# EAGLE design Port-Exp (EAGLE 7.6.0)
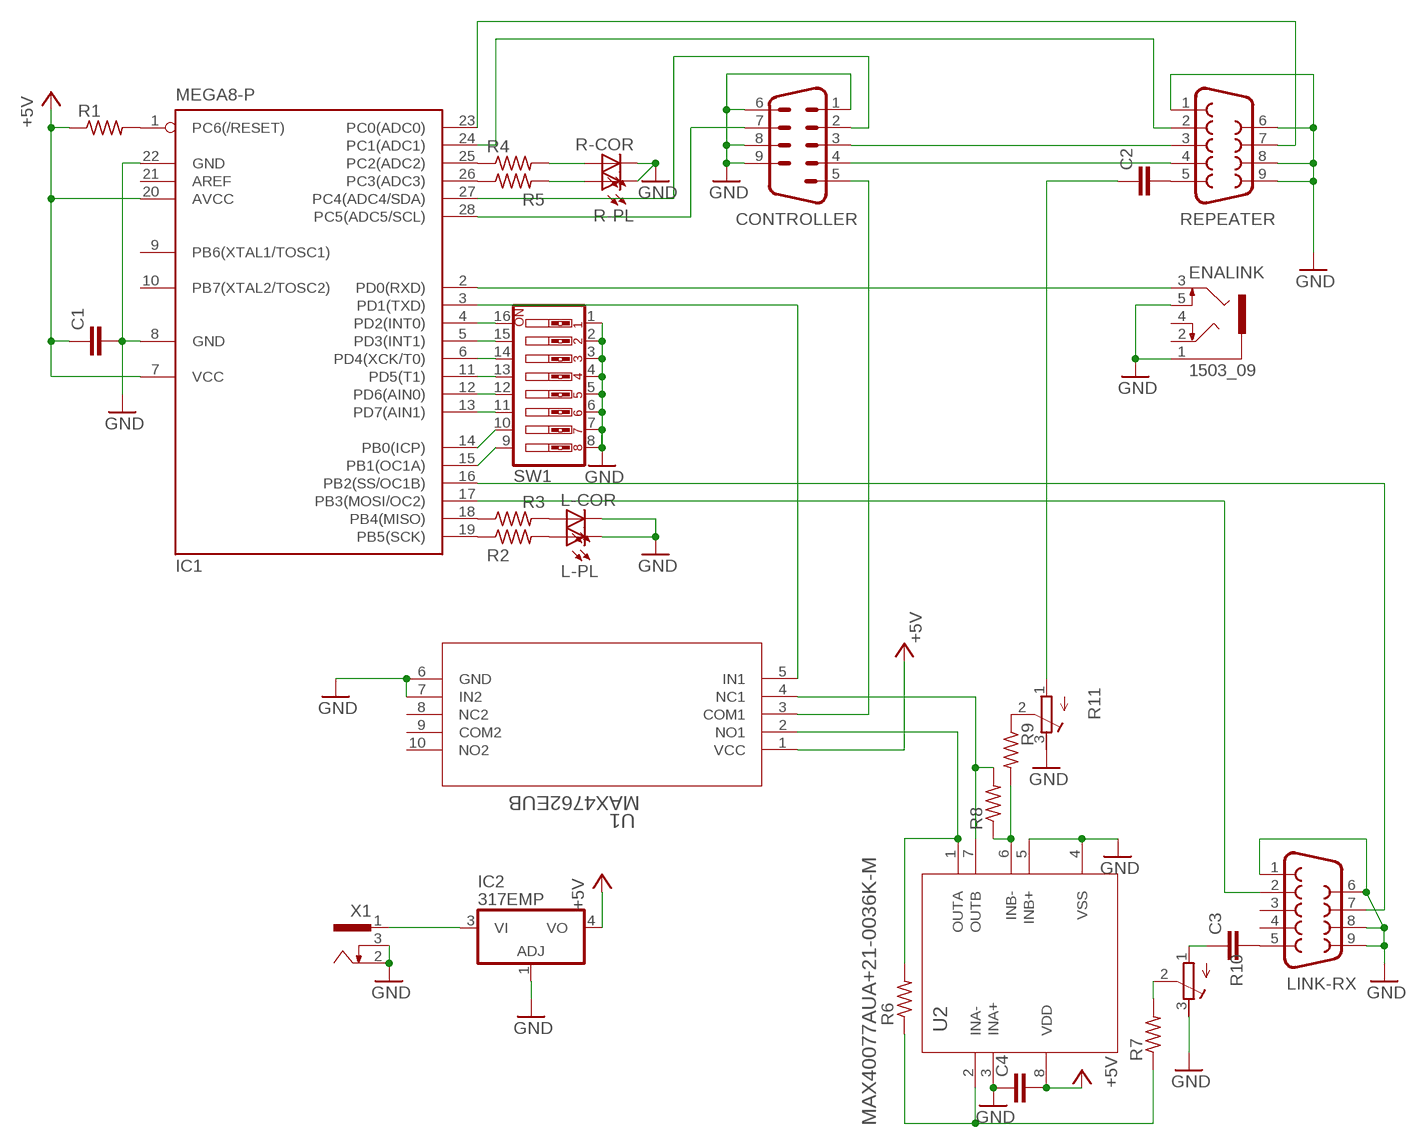
[diagram p0: schematic, sheet 1]

## Parts
C1  C-EUC0402K  [C0402K]
C2  C-EUC0402K  [C0402K]
C3  C-EUC0402K  [C0402K]
C4  C-EUC0402K  [C0402K]
CONTROLLER  M09D  [M09D]
ENALINK  1503_09  [1503_09]
IC1  MEGA8-P  [DIL28-3]
IC2  317EMP  [SOT223]
L-COR  LEDCHIPLED_0805  [CHIPLED_0805]
L-PL  LEDCHIPLED_0805  [CHIPLED_0805]
LINK-RX  F09D  [F09D]
R1  R-US_M0805  [M0805]
R2  R-US_M0805  [M0805]
R3  R-US_M0805  [M0805]
R4  R-US_M0805  [M0805]
R5  R-US_M0805  [M0805]
R6  R-US_M0805  [M0805]
R7  R-US_M0805  [M0805]
R8  R-US_M0805  [M0805]
R9  R-US_M0805  [M0805]
R10  R-TRIMM3339P  [RTRIM3339P]
R11  R-TRIMM3339P  [RTRIM3339P]
R-COR  LEDCHIPLED_0805  [CHIPLED_0805]
R-PL  LEDCHIPLED_0805  [CHIPLED_0805]
REPEATER  F09D  [F09D]
SW1  SW_DIP-8  [EDG-08]
U1  MAX4762EUB  [21-0061L]
U2  MAX40077AUA+21-0036K-M  [21-0036K-M]
X1  SCD-014A  [SCD-014-A]

## Nets
+5V: C1.1 C4.2 IC1.7(VCC) IC1.20(AVCC) IC2.4(VO) R1.1 U1.1(VCC) U2.8(VDD)
GND: C1.2 C4.1 CONTROLLER.1 CONTROLLER.6 CONTROLLER.8 CONTROLLER.9 ENALINK.1 ENALINK.5 IC1.8(GND) IC1.22(GND) IC2.1(ADJ) L-COR.C L-PL.C LINK-RX.1 LINK-RX.6 LINK-RX.8 LINK-RX.9 R10.3(E) R11.3(E) R-COR.C R-PL.C REPEATER.1 REPEATER.6 REPEATER.8 REPEATER.9 SW1.1 SW1.2 SW1.3 SW1.4 SW1.5 SW1.6 SW1.7 SW1.8 U1.6(GND) U1.7(IN2) U2.3(INA+) U2.4(VSS) U2.5(INB+) X1.2 X1.3
N$1: CONTROLLER.2 IC1.27(PC4(ADC4/SDA))
N$2: CONTROLLER.7 IC1.28(PC5(ADC5/SCL))
N$3: IC1.17(PB3(MOSI/OC2)) LINK-RX.2
N$4: CONTROLLER.3 REPEATER.3
N$5: CONTROLLER.4 REPEATER.4
N$6: IC1.24(PC1(ADC1)) REPEATER.2
N$7: IC1.4(PD2(INT0)) SW1.16
N$8: IC1.3(PD1(TXD)) U1.5(IN1)
N$9: IC1.16(PB2(SS/OC1B)) LINK-RX.7
N$10: CONTROLLER.5 U1.3(COM1)
N$11: IC1.23(PC0(ADC0)) REPEATER.7
N$12: IC1.5(PD3(INT1)) SW1.15
N$13: IC1.6(PD4(XCK/T0)) SW1.14
N$14: IC1.11(PD5(T1)) SW1.13
N$15: IC1.12(PD6(AIN0)) SW1.12
N$16: IC1.13(PD7(AIN1)) SW1.11
N$17: IC1.14(PB0(ICP)) SW1.10
N$18: IC1.15(PB1(OC1A)) SW1.9
N$19: IC1.1(PC6(/RESET)) R1.2
N$20: IC1.19(PB5(SCK)) R2.1
N$21: IC1.18(PB4(MISO)) R3.1
N$22: IC1.25(PC2(ADC2)) R4.1
N$23: IC1.26(PC3(ADC3)) R5.1
N$24: R4.2 R-COR.A
N$25: R5.2 R-PL.A
N$26: L-COR.A R3.2
N$27: L-PL.A R2.2
N$28: R6.2 U1.2(NO1) U2.1(OUTA)
N$29: R8.2 U1.4(NC1) U2.7(OUTB)
N$30: C2.2 REPEATER.5
N$31: C3.2 LINK-RX.5
N$32: R8.1 R9.2 U2.6(INB-)
N$33: R6.1 R7.1 U2.2(INA-)
N$34: R9.1 R11.2(S)
N$35: C3.1 R10.1(A)
N$36: R7.2 R10.2(S)
N$37: C2.1 R11.1(A)
N$38: ENALINK.3 IC1.2(PD0(RXD))
N$39: IC2.3(VI) X1.1
Unconnected: ENALINK.2 ENALINK.4 IC1.9(PB6(XTAL1/TOSC1)) IC1.10(PB7(XTAL2/TOSC2)) IC1.21(AREF) LINK-RX.3 LINK-RX.4 U1.8(NC2) U1.9(COM2) U1.10(NO2)

## Library data of the parts
C1-C4 = rcl:C-EU: CAPACITOR, European symbol
CONTROLLER = con-subd:M09: SUB-D; OC_FARNELL: unknown; OC_NEWARK: unknown
ENALINK = con-lumberg:1503_09: Jack connectors according to JISC 6560, 3.5 mm Klinkeneinbaukupplung nach JISC 6560, 3,5 mm, 3-polig/ stereo, abgewinkelte Ausführung, mit 2 Öffnern und Lötaugen, für Leiterplatten Rückseitenmontage Source: http://www.lumberg.com/Produkte/PDFs/1503_09.pdf; OC_FARNELL: 1243244; OC_NEWARK: unknown
IC1 = atmel:MEGA8-P: MICROCONTROLLER 8 Kbytes FLASH, 1 kbytes SRAM, 512 bytes EEPROM, USART, 4-channel 10 bit ADC, 2-channel 8 bit ADC Pin compatible with Atmega48, ATMega88, ATMega168 Source: avr.lbr; OC_FARNELL: unknown; OC_NEWARK: unknown
IC2 = linear:*317: Positive VOLTAGE REGULATOR
L-COR L-PL R-COR R-PL = led:LED: LED OSRAM: - CHIPLED LG R971, LG N971, LY N971, LG Q971, LY Q971, LO R971, LY R971 LH N974, LH R974 LS Q976, LO Q976, LY Q976 LO Q996 - Hyper CHIPLED LW Q18S LB Q993, LB Q99A, LB R99A - SideLED LS A670, LO A670, LY A670, LG A670, LP A670 LB A673, LV A673, LT A673, LW A673 LH A674 LY A675 LS A676, LA A676, LO A676, LY A676, LW A676 LS A679, LY A679, LG A679 - Hyper Micro SIDELED® LS Y876, LA Y876, LO Y876, LY Y876 LT Y87S - SmartLED LW L88C, LW L88S LB L89C, LB L89S, LG L890 LS L89K, LO L89K, LY L89K LS L896, LA L896, LO L896, LY L896 - TOPLED LS T670, LO T670, LY T670, LG T670, LP T670 LSG T670, LSP T670, LSY T670, LOP T670, LYG T670 LG T671, LOG T671, LSG T671 LB T673, LV T673, LT T673, LW T673 LH T674 LS T676, LA T676, LO T676, LY T676, LB T676, LH T676, LSB T676, LW T676 LB T67C, LV T67C, LT T67C, LS T67K, LO T67K, LY T67K, LW E67C LS E67B, LA E67B, LO E67B, LY E67B, LB E67C, LV E67C, LT E67C LW T67C LS T679, LY T679, LG T679 LS T770, LO T770, LY T770, LG T770, LP T770 LB T773, LV T773, LT T773, LW T773 LH T774 LS E675, LA E675, LY E675, LS T675 LS T776, LA T776, LO T776, LY T776, LB T776 LHGB T686 LT T68C, LB T68C - Hyper Mini TOPLED® LB M676 - Mini TOPLED Santana® LG M470 LS M47K, LO M47K, LY M47K Source: http://www.osram.convergy.de LUXEON: - LUMILED® LXK2-PW12-R00, LXK2-PW12-S00, LXK2-PW14-U00, LXK2-PW14-V00 LXK2-PM12-R00, LXK2-PM12-S00, LXK2-PM14-U00 LXK2-PE12-Q00, LXK2-PE12-R00, LXK2-PE12-S00, LXK2-PE14-T00, LXK2-PE14-U00 LXK2-PB12-K00, LXK2-PB12-L00, LXK2-PB12-M00, LXK2-PB14-N00, LXK2-PB14-P00, LXK2-PB14-Q00 LXK2-PR12-L00, LXK2-PR12-M00, LXK2-PR14-Q00, LXK2-PR14-R00 LXK2-PD12-Q00, LXK2-PD12-R00, LXK2-PD12-S00 LXK2-PH12-R00, LXK2-PH12-S00 LXK2-PL12-P00, LXK2-PL12-Q00, LXK2-PL12-R00 Source: www.luxeon.com KINGBRIGHT: KA-3528ASYC Source: www.kingbright.com
LINK-RX REPEATER = con-subd:F09: SUB-D; OC_FARNELL: unknown; OC_NEWARK: unknown
R1-R9 = rcl:R-US_: RESISTOR, American symbol
R10 R11 = rcl:R-TRIMM: Trimm resistor
SW1 = special:SW_DIP-8: DIP SWITCH
U1 = maxim:MAX4762EUB; MANUFACTURER_PART_NUMBER: MAX4762EUB; VENDOR: Maxim Integrated Products
U2 = maxim:MAX40077AUA+; MANUFACTURER_PART_NUMBER: MAX40077AUA+; VENDOR: Maxim Integrated Products
X1 = con-shiua-chyuan:SCD-014A: Power Jack 2.5mm; OC_FARNELL: unknown; OC_NEWARK: unknown

## Board
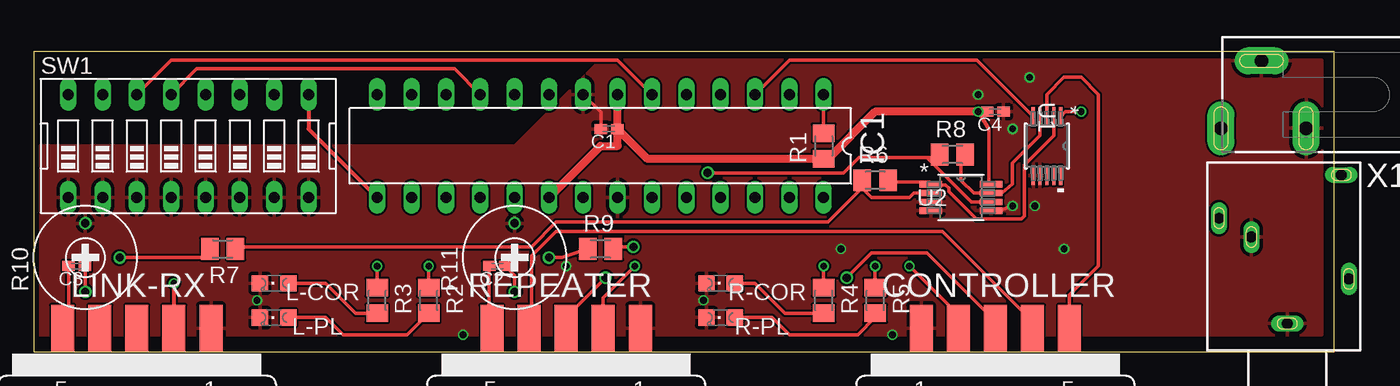
[diagram p1: board, top side]
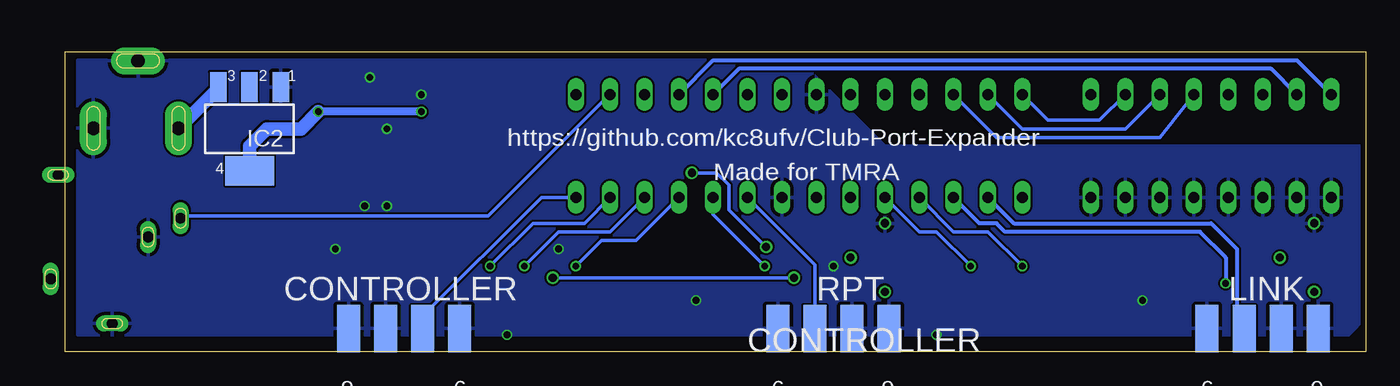
[diagram p2: board, bottom side, seen from below]

Size 96.19 x 22.23 mm. Coordinates in mm from the lower left corner, seen from the top.
Outline: 0,0 96.19,0 96.19,22.23 0,22.23 0,0
Copper layers (1*16): Top 0.035559375mm / dielectric 1.6mm / Bottom 0.035559375mm
Design rules "oshpark-2layer": minimum track width 6mil, minimum drill 10mil, track to track 6mil, track to pad 6mil, pad to pad 6mil, via to via 6mil, smd to smd 6mil, copper to edge 15mil, drill to drill 6mil, minimum pad ring 5mil, minimum via ring 5mil, stop-mask expansion 2.5mil, vias tented up to drill 0mil, thermal gap 10mil

### Footprints (pad centres in the part's own frame; a part is rotated, then mirrored left to right if it is on the bottom)
C0402K = smd 0.925 x 0.74: 1 -0.6,0; 2 0.6,0
M09D = smd 1.7 x 3.5: 1 5.486,-6.045; 2 2.743,-6.045; 3 0,-6.045; 4 -2.743,-6.045; 5 -5.486,-6.045 | smd 1.7 x 3.5 bottom: 6 4.115,-6.045; 7 1.372,-6.045; 8 -1.372,-6.045; 9 -4.115,-6.045
1503_09 = drill 0.8 pad 1.2 long: 1 0,-2.1; 2 -4.55,-5.4; 3 5.05,-9.9; 4 -4,-13.1; 5 2.65,-8.5
DIL28-3 = drill 0.813 long: 1 -16.51,-3.81; 2 -13.97,-3.81; 3 -11.43,-3.81; 4 -8.89,-3.81; 5 -6.35,-3.81; 6 -3.81,-3.81; 7 -1.27,-3.81; 8 1.27,-3.81; 9 3.81,-3.81; 10 6.35,-3.81; 11 8.89,-3.81; 12 11.43,-3.81; 13 13.97,-3.81; 14 16.51,-3.81; 15 16.51,3.81; 16 13.97,3.81; 17 11.43,3.81; 18 8.89,3.81; 19 6.35,3.81; 20 3.81,3.81; 21 1.27,3.81; 22 -1.27,3.81; 23 -3.81,3.81; 24 -6.35,3.81; 25 -8.89,3.81; 26 -11.43,3.81; 27 -13.97,3.81; 28 -16.51,3.81
SOT223 = smd 1.219 x 2.235: 1 -2.311,-3.099; 2 0,-3.099; 3 2.311,-3.099 | smd 3.6 x 2.2: 4 0,3.099
CHIPLED_0805 = smd 1.2 x 1.2: A 0,-1.05; C 0,1.05
F09D = smd 1.7 x 3.5: 1 -5.486,-6.045; 2 -2.743,-6.045; 3 0,-6.045; 4 2.743,-6.045; 5 5.486,-6.045 | smd 1.7 x 3.5 bottom: 6 -4.115,-6.045; 7 -1.372,-6.045; 8 1.372,-6.045; 9 4.115,-6.045
M0805 = smd 1.3 x 1.6: 1 -0.95,0; 2 0.95,0
RTRIM3339P = drill 0.61: 1 -2.54,0; 2 0,-2.54; 3 2.54,0
EDG-08 = drill 0.813 long: 1 -8.89,-3.81; 2 -6.35,-3.81; 3 -3.81,-3.81; 4 -1.27,-3.81; 5 1.27,-3.81; 6 3.81,-3.81; 7 6.35,-3.81; 8 8.89,-3.81; 9 8.89,3.81; 10 6.35,3.81; 11 3.81,3.81; 12 1.27,3.81; 13 -1.27,3.81; 14 -3.81,3.81; 15 -6.35,3.81; 16 -8.89,3.81
21-0061L = smd 1.422 x 0.229: 1 -2.172,1.016; 2 -2.172,0.508; 3 -2.172,0; 4 -2.172,-0.508; 5 -2.172,-1.016; 6 2.172,-1.016; 7 2.172,-0.508; 8 2.172,0; 9 2.172,0.508; 10 2.172,1.016
21-0036K-M = smd 1.676 x 0.457: 1 -2.235,0.975; 2 -2.235,0.325; 3 -2.235,-0.325; 4 -2.235,-0.975; 5 2.235,-0.975; 6 2.235,-0.325; 7 2.235,0.325; 8 2.235,0.975
SCD-014-A = drill 1 pad 2 long: 1 -2.5,13.8; 2 -2.5,7.5; 3 2.5,10.8

### Placement (x,y rotation side)
C1  42.55,16.51 180 top
C2  34.29,6.35 180 top
C3  3.17,6.35 180 top
C4  71.12,17.78 180 top
CONTROLLER  71.12,-4.32 180 top
ENALINK  92.71,0 180 top
IC1  41.91,15.24 180 top
IC2  82.55,16.51 180 bottom
L-COR  17.78,5.08 90 top
L-PL  17.78,2.54 90 top
LINK-RX  7.62,-4.32 180 top
R1  58.42,15.24 90 top
R2  29.21,3.81 270 top
R3  25.4,3.81 270 top
R4  58.42,3.81 270 top
R5  62.23,3.81 270 top
R6  62.23,12.7 0 top
R7  13.97,7.62 180 top
R8  67.94,14.61 0 top
R9  41.91,7.62 0 top
R10  3.81,6.99 90 top
R11  35.56,6.99 90 top
R-COR  50.8,5.08 90 top
R-PL  50.8,2.54 90 top
REPEATER  39.37,-4.32 180 top
SW1  11.43,15.24 0 top
U1  74.93,15.24 270 top
U2  68.58,11.43 0 top
X1  101.6,19.05 90 top

### Tracks (layer width: path | path; a pad name or v marks a point on that pad's centre or on a via)
+5V  (via drill 0.5)
  Top 0.254: v77.47,17.78 76.31,17.78 U1.1 | v69.85,17.78 69.95,17.6 69.95,17.78 v69.85,17.78 | v69.85,17.78 70.64,16.51 70.64,12.57 U2.8 | v69.85,17.78 C4.2
  Top 0.61: v69.85,17.78 62.23,17.78 58.74,14.29 R1.1 45.4,14.29 43.18,16.51 | 43.18,16.51 IC1.7 | IC1.20 41.91,15.24 43.18,15.24 43.18,16.48 C1.1 43.18,16.51
  Bottom 0.61: v69.85,17.78 v77.47,17.78
  Bottom 1.016: IC2.4 82.55,15.24 81.28,16.51 78.74,16.51 v77.47,17.78
GND  (via drill 0.5)
  Top 0.254: C1.2 41.95,17.75 IC1.8 | U2.5 71.42,10.46 v72.39,10.79
  other vias: 16.51,3.81 49.53,3.81 31.75,1.27 63.5,1.27 76.2,7.62 74.04,10.79 72.39,16.51 69.85,19.05 39.37,6.35 73.66,20.32 59.69,7.62
  pour Top: 0,1.27 95.25,1.27 95.25,21.59 41.91,21.59 35.56,15.24 0,15.24
  pour Bottom: 95.25,21.59 41.91,21.59 35.56,15.24 0,15.24 0,2.54 1.27,1.27 95.25,1.27
N$1  (via drill 0.5)
  Top 0.254: v64.77,6.35 68.58,2.54 68.58,1.93 CONTROLLER.2
  Bottom 0.254: IC1.27 57.78,9.53 61.59,9.53 v64.77,6.35
N$2
  Bottom 0.254: IC1.28 60.96,11.43 69.85,2.54 69.85,1.83 CONTROLLER.7
N$3  (via drill 0.5)
  Top 0.305: v10.36,5.08 LINK-RX.2
  Bottom 0.305: IC1.17 28.57,9.53 27.3,9.53 26.67,8.89 12.27,8.89 10.36,6.99 v10.36,5.08
N$4  (via drill 0.61)
  Top 0.254: v42.29,5.49 39.55,2.74 39.55,1.83 REPEATER.3 | v60.12,5.49 61.95,7.32 66.06,7.32 71.09,2.29 71.09,1.83 CONTROLLER.3
  Bottom 0.254: v60.12,5.49 v42.29,5.49
N$5
  Top 0.254: REPEATER.4 36.8,1.83 36.8,7.09 38.63,8.91 67.21,8.91 73.84,2.29 73.84,1.83 CONTROLLER.4
N$6  (via drill 0.5)
  Top 0.254: v44.45,6.35 42.11,4.01 REPEATER.2
  Bottom 0.254: IC1.24 48.26,10.16 v44.45,6.35
N$7
  Bottom 0.305: IC1.4 48.26,21.59 5.08,21.59 SW1.16
N$8
  Top 0.254: IC1.3 55.88,21.59 69.74,21.59 U1.5
N$9
  Bottom 0.305: IC1.16 26.04,9.53 11.43,9.53 9.53,7.62 9.53,1.78 LINK-RX.7
N$10
  Top 0.254: U1.3 74.93,19.05 76.2,20.32 77.47,20.32 78.74,19.05 78.74,6.35 76.61,4.22 CONTROLLER.5
N$11
  Bottom 0.254: REPEATER.7 40.74,6.45 IC1.23
N$12
  Bottom 0.305: SW1.15 6.99,20.95 46.35,20.95 IC1.5
N$13
  Top 0.254: IC1.6 43.18,21.59 10.16,21.59 SW1.14
N$14
  Top 0.254: SW1.13 12.06,20.95 31.11,20.95 IC1.11
N$15
  Bottom 0.254: SW1.12 15.24,15.88 27.3,15.88 IC1.12
N$16
  Bottom 0.254: SW1.11 17.78,16.51 25.4,16.51 IC1.13
N$17
  Bottom 0.254: SW1.10 19.68,17.14 23.5,17.14 IC1.14
N$18
  Top 0.305: SW1.9 20.32,16.51 IC1.15
N$19
  Top 0.254: R1.2 IC1.1
N$20  (via drill 0.5)
  Top 0.254: v29.21,6.35 R2.1
  Bottom 0.254: IC1.19 33.02,8.89 31.75,8.89 v29.21,6.35
N$21  (via drill 0.5)
  Top 0.254: v25.4,6.35 R3.1
  Bottom 0.254: IC1.18 30.48,8.89 27.94,8.89 v25.4,6.35
N$22  (via drill 0.5)
  Top 0.254: v58.42,6.35 R4.1
  Bottom 0.254: IC1.25 53.98,8.26 56.52,8.26 v58.42,6.35
N$23  (via drill 0.5)
  Top 0.254: v62.23,6.35 R5.1
  Bottom 0.254: IC1.26 55.88,8.89 59.69,8.89 v62.23,6.35
N$24
  Top 0.254: R4.2 55.56,2.86 53.34,5.08 R-COR.A
N$25
  Top 0.254: R5.2 62.23,2.54 60.96,1.27 55.88,1.27 54.61,2.54 R-PL.A
N$26
  Top 0.254: R3.2 23.81,2.86 21.59,5.08 L-COR.A
N$27
  Top 0.254: L-PL.A 21.59,2.54 22.86,1.27 27.62,1.27 R2.2
N$28
  Top 0.254: U1.2 75.44,16 73.28,13.84 73.28,10.06 73.05,9.83 69.72,9.83 67.67,11.89 67.67,12.12 67.44,12.34 66.52,12.34 U2.1 66.29,12.57 63.32,12.57 R6.2
N$29
  Top 0.254: R8.2 68.58,14.29 68.58,12.7 69.53,11.76 U2.7 71.6,11.76 72.39,12.42 72.39,13.97 74.42,16 U1.4
N$30
  Top 0.254: C2.2 33.69,1.92 REPEATER.5
N$31
  Top 0.254: C3.2 2.58,2.17 LINK-RX.5
N$32  (via drill 0.61)
  Top 0.254: v44.35,7.77 42.98,7.77 R9.2 | v49.84,13.26 59.89,13.26 61.04,14.4 66.04,14.4 | 66.04,14.4 66.98,14.4 R8.1 | U2.6 69.34,11.11 66.04,14.4
  Bottom 0.254: v44.35,7.77 47.09,10.52 47.09,12.34 48.01,13.26 v49.84,13.26
N$33
  Top 0.254: 61.27,12.12 58.75,9.6 38.63,9.6 36.8,7.77 15.09,7.77 R7.1 | 61.27,12.12 61.27,12.57 R6.1 | U2.2 65.09,11.76 64.77,11.43 61.95,11.43 61.27,12.12
N$34
  Top 0.254: R11.2 39.05,6.99 R9.1
N$35
  Top 0.254: R10.1 3.81,6.32 C3.1
N$36
  Top 0.254: R10.2 12.38,6.99 R7.2
N$37
  Top 0.254: R11.1 35.56,5.68 C2.1
N$38
  Bottom 0.254: ENALINK.3 87.55,10.06 64.92,10.06 56.01,18.97 IC1.2
N$39
  Bottom 1.016: IC2.3 84.86,19.49 X1.1

### Text on the board
bNames: https://github.com/kc8ufv/Club-Port-Expander | Made for TMRA | LINK | RPT | CONTROLLER | CONTROLLER